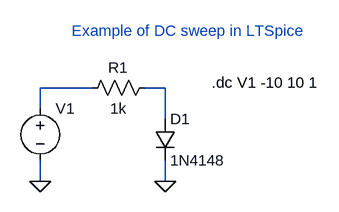
[diagram p0: schematic Example-of-DC-sweep.asc]
Example-of-DC-sweep.asc, the LTspice schematic file:
Version 4.1
SHEET 1 880 680
WIRE 160 80 80 80
WIRE 272 80 240 80
WIRE 80 112 80 80
WIRE 272 128 272 80
WIRE 80 224 80 192
WIRE 272 224 272 192
FLAG 80 224 0
FLAG 272 224 0
SYMBOL voltage 80 96 R0
WINDOW 123 0 0 Left 2
WINDOW 39 0 0 Left 2
SYMATTR InstName V1
SYMATTR Value ""
SYMBOL res 256 64 R90
WINDOW 0 0 56 VBottom 2
WINDOW 3 32 56 VTop 2
SYMATTR InstName R1
SYMATTR Value 1k
SYMBOL diode 256 128 R0
SYMATTR InstName D1
SYMATTR Value 1N4148
TEXT 344 72 Left 2 !.dc V1 -10 10 1
TEXT 128 -8 Left 2 ;Example of DC sweep in LTSpice

The netlist it stands for:
* Example-of-DC-sweep.asc
V1 N001 0
R1 N002 N001 1k
D1 N002 0 1N4148
.model D D
.lib standard.dio
.dc V1 -10 10 1
* Example of DC sweep in LTSpice
.backanno
.end